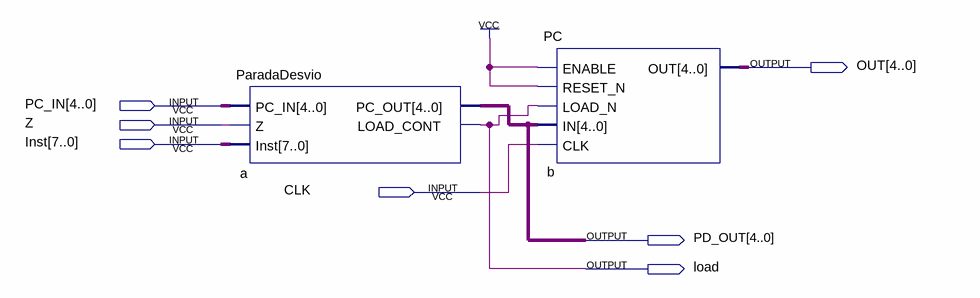
[diagram p0: schematic sheet]
// Quartus schematic Teste.bdf as structural Verilog: 2 symbols, 7 pins
module Teste (
  input  [4:0] PC_IN,
  input  Z,
  input  [7:0] Inst,
  input  CLK,
  output [4:0] OUT,
  output [4:0] PD_OUT,
  output load
);

  ParadaDesvio a (.PC_IN(PC_IN), .Z(Z), .Inst(Inst), .PC_OUT(PD_OUT), .LOAD_CONT(load));
  PC b (.ENABLE(1'b1), .RESET_N(1'b1), .LOAD_N(load), .IN(PD_OUT), .CLK(CLK), .OUT(OUT));
endmodule
